# Altium schematic sheet schematic.schdoc
size A3; SheetNumber: 1; SheetTotal: 1
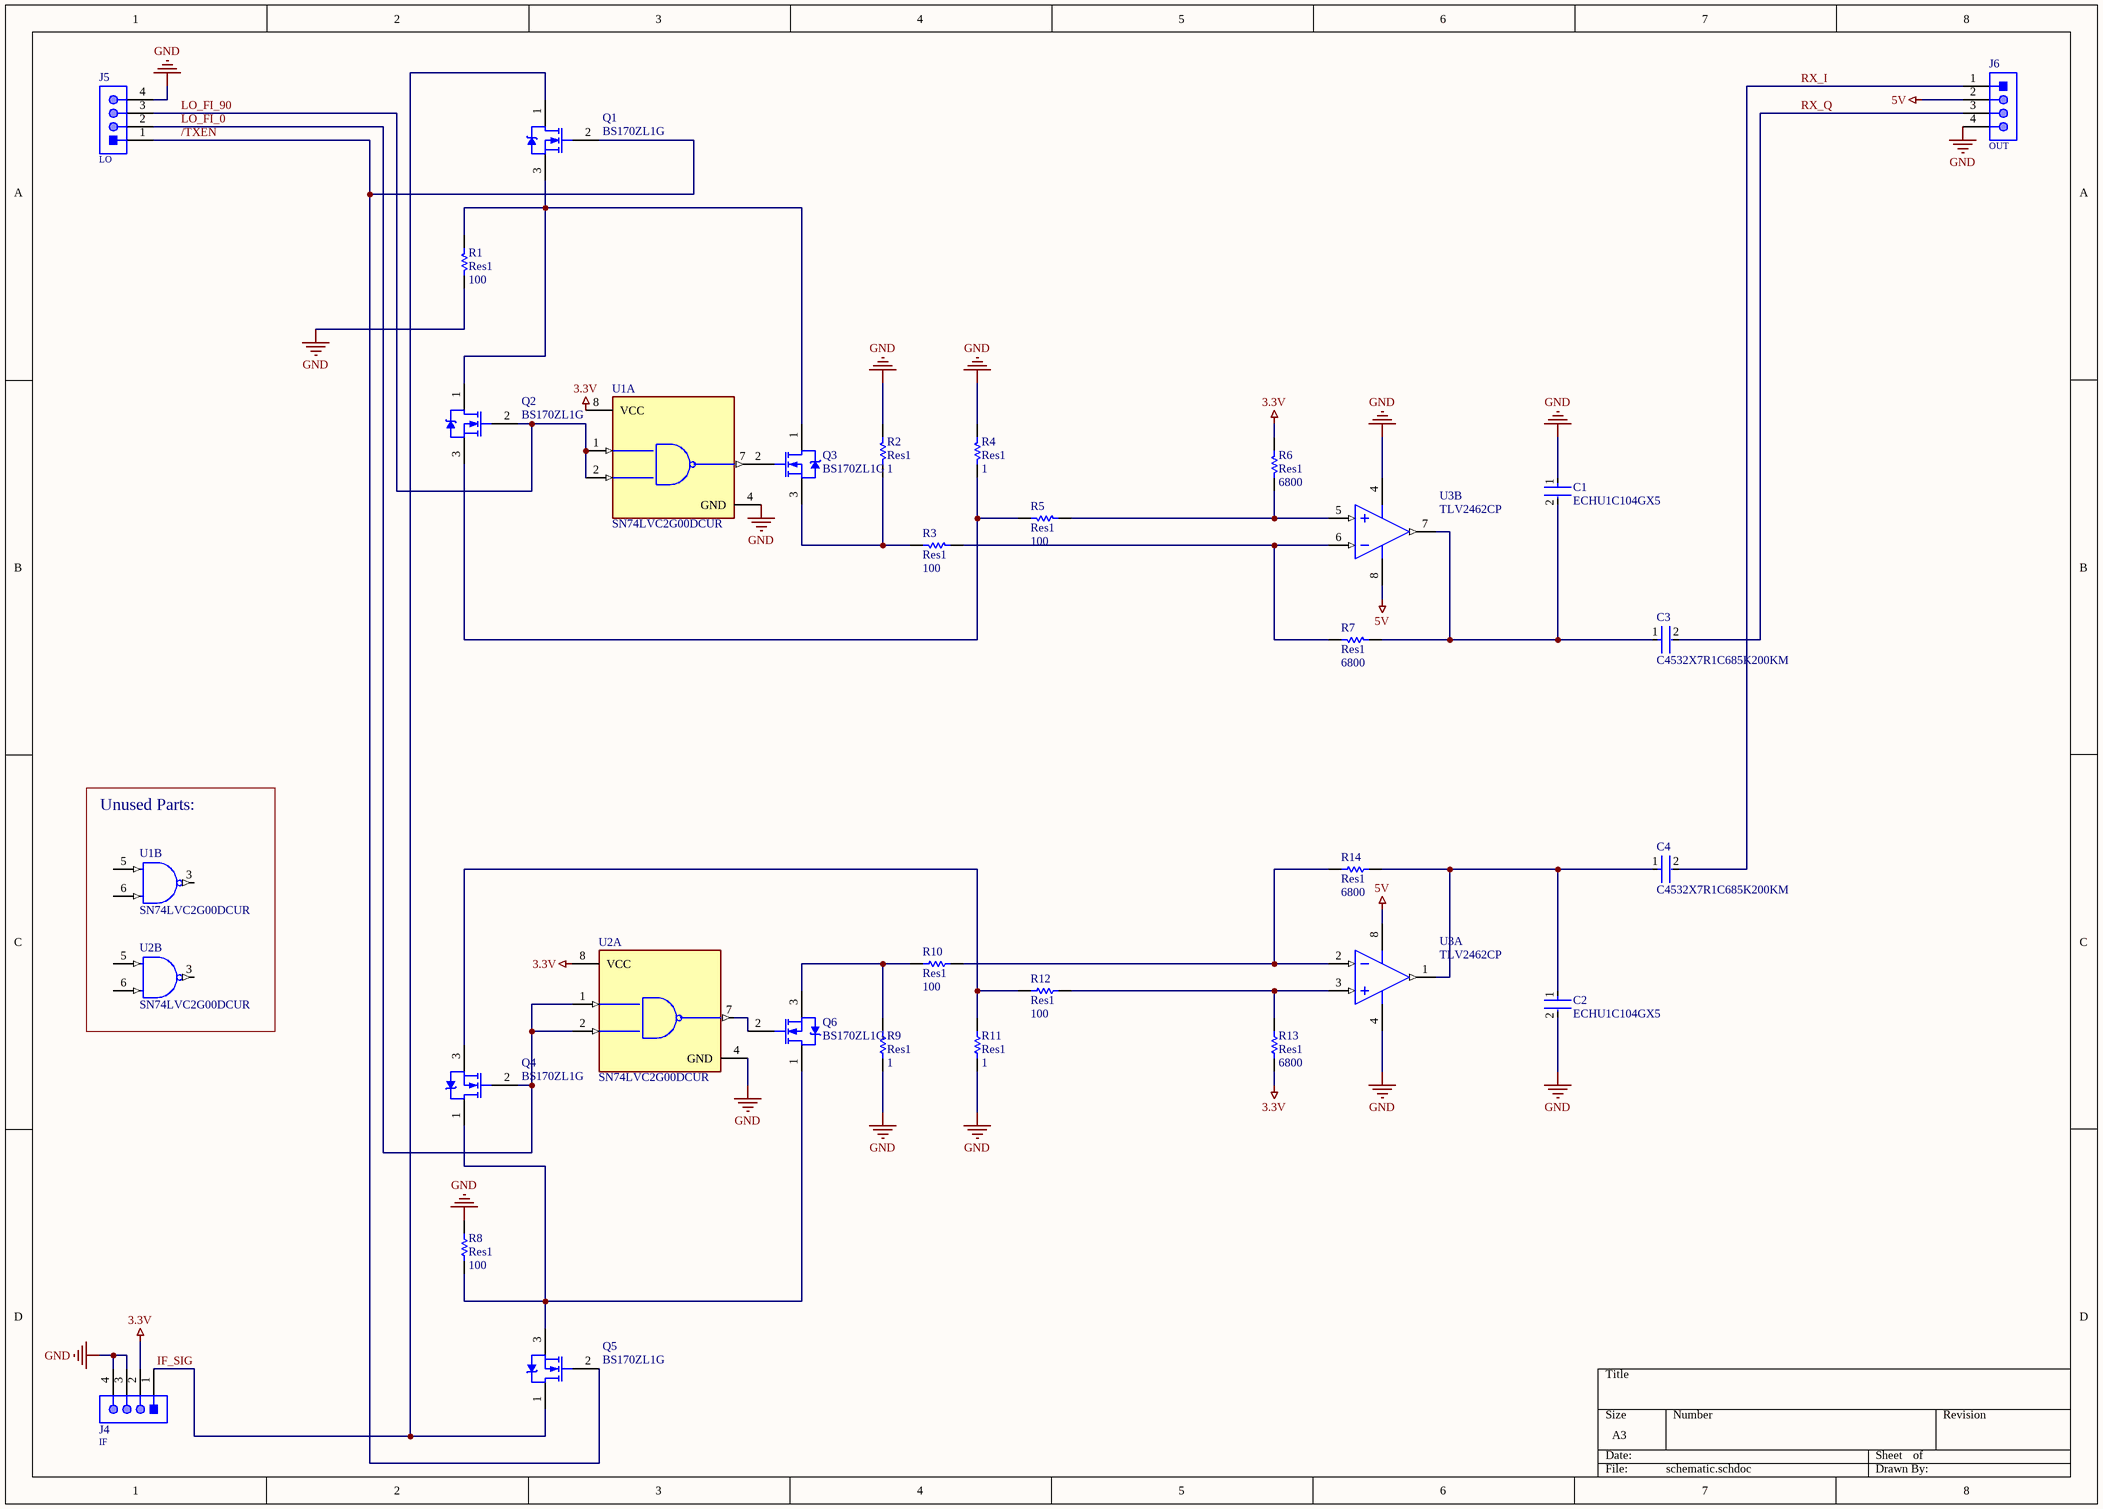
[diagram p0: schematic.schdoc]

## Parts
C1  ECHU1C104GX5  [FP-ECHUG3-MFG]
C2  ECHU1C104GX5  [FP-ECHUG3-MFG]
C3  C4532X7R1C685K200KM  [FP-C4532-200-0_4-IPC_B]
C4  C4532X7R1C685K200KM  [FP-C4532-200-0_4-IPC_B]
J4  IF  [61300411121]
J5  LO  [61300411121]
J6  OUT  [61300411121]
Q1  BS170ZL1G  [ONSC-TO-92-3-29-11_AM_BL]
Q2  BS170ZL1G  [ONSC-TO-92-3-29-11_AM_BL]
Q3  BS170ZL1G  [ONSC-TO-92-3-29-11_AM_BL]
Q4  BS170ZL1G  [ONSC-TO-92-3-29-11_AM_BL]
Q5  BS170ZL1G  [ONSC-TO-92-3-29-11_AM_BL]
Q6  BS170ZL1G  [ONSC-TO-92-3-29-11_AM_BL]
R1  Res1  value 100  [RAD-0.1]
R2  Res1  value 1  [RAD-0.1]
R3  Res1  value 100  [RAD-0.1]
R4  Res1  value 1  [RAD-0.1]
R5  Res1  value 100  [RAD-0.1]
R6  Res1  value 6800  [RAD-0.1]
R7  Res1  value 6800  [RAD-0.1]
R8  Res1  value 100  [RAD-0.1]
R9  Res1  value 1  [RAD-0.1]
R10  Res1  value 100  [RAD-0.1]
R11  Res1  value 1  [RAD-0.1]
R12  Res1  value 100  [RAD-0.1]
R13  Res1  value 6800  [RAD-0.1]
R14  Res1  value 6800  [RAD-0.1]
U1  SN74LVC2G00DCUR  [FP-DCU0008A-IPC_C]  (parts A,B of 2)
U2  SN74LVC2G00DCUR  [FP-DCU0008A-IPC_C]  (parts A,B of 2)
U3  TLV2462CP  [P0008A]  (parts A,B of 2)

## Blocks framed on the sheet
Unused Parts:: U1 U2

## Nets
3.3V: J4.2 R6.1 R13.1 U1.8(VCC) U2.8(VCC)
5V: J6.2 U3.8(VDD+)
GND: C1.1 C2.2 J4.3 J4.4 J5.4 J6.4 R1.2 R2.1 R4.1 R8.2 R9.1 R11.1 U1.4(GND) U2.4(GND) U3.4(GND)
/TXEN: J5.1 Q1.2(G) Q5.2(G)
IF_SIG: J4.1 Q1.1(D) Q5.1(D)
LO_FI_0: J5.2 Q4.2(G) U2.1(1A) U2.2(1B)
LO_FI_90: J5.3 Q2.2(G) U1.1(1A) U1.2(1B)
RX_I: C4.2 J6.1
RX_Q: C3.2 J6.3
NetC1_2: C1.2 C3.1 R7.2 U3.7(OUT2)
NetC2_1: C2.1 C4.1 R14.2 U3.1(OUT1)
NetQ1_3: Q1.3(S) Q2.1(D) Q3.1(D) R1.1
NetQ2_3: Q2.3(S) R4.2 R5.1
NetQ3_2: Q3.2(G) U1.7(1Y)
NetQ3_3: Q3.3(S) R2.2 R3.1
NetQ4_1: Q4.1(D) Q5.3(S) Q6.1(D) R8.1
NetQ4_3: Q4.3(S) R11.2 R12.1
NetQ6_2: Q6.2(G) U2.7(1Y)
NetQ6_3: Q6.3(S) R9.2 R10.1
NetR3_2: R3.2 R7.1 U3.6(IN2-)
NetR5_2: R5.2 R6.2 U3.5(IN2+)
NetR10_2: R10.2 R14.1 U3.2(IN1-)
NetR12_2: R12.2 R13.2 U3.3(IN1+)

Not connected (* = marked no-connect by the designer): U1 3(2Y) 5(2A) 6(2B); U2 3(2Y) 5(2A) 6(2B)

## Library data of the parts
C1 C2 = CMP-05434-000004-1: CAP FILM 0.1UF 2% 16VDC 1210; Dissipation Factor: 0.6%; Dielectric: PPS; Voltage: 16V; Life (Hours): 500Hour; Insulation Resistance: 3GR; Capacitance: 100nF; Dielectric Material: Polyphenylene; Construction: Flat; RoHS Compliant: Yes; Package Quantity: 1; Tolerance: 2%; Case Code (Imperial): 1210; Packaging: Tape and Reel; Width: 2.5mm; Number of Pins: 2; Height: 2.1mm; Lead Free: Lead Free; Case Code (Metric): 3225; REACH SVHC: No SVHC; Series: ECHU(X); Length: 3.2mm; Height - Seated (Max): 0.091inch; Max Operating Temperature: 125°C; Min Operating Temperature: -55°C; Mount: Surface Mount; Voltage Rating: 16V; Contact Plating: Copper; Termination: SMD/SMT; Voltage Rating (DC): 16V; Radiation Hardening: No; Depth: 2.5mm; Case/Package: 1210
C3 C4 = CMP-08246-005601-1: Multilayer Ceramic Capacitors 6.8uF ±10% 16V X7R SMD 1812; Thickness: 0.087inch; Number of Pins: 2; Weight: 0.000952oz; Depth: 3.2mm; RoHS Compliant: Yes; Case Code (Metric): 4532; Case/Package: 1812; Mount: Surface Mount; Packaging: Tape and Reel; Min Operating Temperature: -55°C; Length: 0.177inch; Dielectric: X7R; Case Code (Imperial): 1812; Width: 0.126inch; Series: C; Capacitance: 6.8uF; Voltage Rating: 16V; Max Operating Temperature: 125°C; Resistor Type: Ceramic; Lead Free: Lead Free; Voltage Rating (DC): 16V; Termination: SMD/SMT; Height: 2mm; Tolerance: 10%; Package Quantity: 1000
J4-J6 = CMP-1502-01064-1: THT Vertical Pin Header WR-PHD, Pitch 2.54 mm, Single Row, 4 pins; Manufacturer: Wurth Elektronik; Withstanding Voltage: 500VAC; Rated Current: 3A; Working Voltage: 250VAC; Pin Number: 4; Gender: Male; Contact Resistance: 20mOhm; Pitch: 2.54mm; Manufacturer URL: http://www.we-online.de; Operating Temperature: -40to105degC; Packaging: Bag; Mounting Technology: THT; Package Reference: 61300411121; Datasheet URL: https://katalog.we-online.de/em/datasheet/6130xx11121.pdf; Publisher: WurthElektronik; Part Number: 61300411121; Row Number: Single; Orientation: Vertical
Q1-Q6 = CMP-1058-00939-1: Small Signal MOSFET, 500 mA, 60 V, N-Channel, 3-Pin TO-92, Pb-Free, Tape and Reel; Manufacturer: On Semiconductor; PD Max (W): 0.35; Channel Polarity: N Channel; VGS Max (V): 20; VGS(th) Max (V): 3; ID Max (A): 0.5; V(BR)DSS Min (V): 60; Configuration: Single; PackageDescription: 3-Pin Transistor Outline, Body 4.825 x 3.685 mm, Pitch 1.27 mm; RoHS: Pb-Free; ComponentLink1URL: http://www.onsemi.com/; ComponentLink1Description: Manufacturer URL; Mounting Technology: Through Hole; ComponentLink3URL: http://www.onsemi.com/pub_link/Collateral/MAC97-D.PDF; Package Type: TO-92; ComponentLink2Description: Datasheet; Packing: Tape and Reel; DatasheetVersion: Rev. 6; PartNumber: BS170ZL1G; PackageVersion: Rev. AM; ComponentLink2URL: http://www.onsemi.com/pub_link/Collateral/BS170-D.PDF; ComponentLink3Description: Package Specification; PackageReference: TO-92-3-29-11_AM_BL
R1-R14 = Res1: Resistor; Published: 8-Jun-2000; LatestRevisionDate: 17-Jul-2002; LatestRevisionNote: Re-released for DXP Platform.; PackageReference: AXIAL-0.3; Publisher: Altium Limited; PackageDescription: Axial Device, Thru-Hole; 2 Leads; 0.3 in Pin Spacing
U1 U2 = CMP-0859-00705-4: IC GATE NAND 2CH 2-INP US8; Number of Input Lines: 2; Quiescent Current: 10uA; Number of Output Lines: 1; Output Current: 32mA; Min Supply Voltage: 1.65V; Max Supply Voltage: 5.5V; Turn-On Delay Time: 3.3ns; High Level Output Current: -32mA; Logic Function: NAND GATE; Case/Package: VSSOP; Number of Gates: 2; Weight: 0.000339oz; Termination: SMD/SMT; Number of Elements: 2; Package Quantity: 1; Min Operating Temperature: -40°C; Number of Outputs: 1; Packaging: Tape and Reel; Low Level Output Current: 32mA; Number of Inputs: 2; Mount: Surface Mount; Contact Plating: Gold; Max Output Current: 32mA; RoHS Compliant: Yes; Radiation Hardening: No; Max Operating Temperature: 125°C; Number of Circuits: 2; Lead Free: Lead Free; Propagation Delay: 3.3ns; Number of Pins: 8; REACH SVHC: No SVHC; Number of Bits: 2
U3 = CMP-0272-01601-3: Dual Low-Power, Rail-to-Rail Input / Output Operational Amplifier, 2.7 to 6 V, 0 to 70 degC, 8-pin DIP (P8), Pb-Free (RoHS); Manufacturer: Texas Instruments; Total Supply Voltage(Max)(+5V is 5, +/-5V is 10): 6; Sub Family: High Output Current Amplifier (>=50mA), Low Supply Voltage Amplifier (<=2.7V), Precision Amplifier; Vio (25C)(Max)(mV): 2; Iq per channel(Max)(mA): 0.575; Slew Rate(Typ)(V/us): 1.6; Total Supply Voltage(Min)(+5V is 5, +/-5V is 10): 2.7; Vn at 1kHz(Typ)(nV/rtHz): 11; CMRR(Min)(dB): 66; IIB(Max)(pA): 14000; ComponentLink2URL: http://www.ti.com/general/docs/lit/getliterature.tsp?genericPartNumber=TLV2462&fileType=pdf; Code_JEDEC: MS-001; PackageReference: P0008A; Number of Channels: 2; ComponentLink1Description: Manufacturer URL; Eco-Plan: Pb-Free (RoHS); PackageDescription: 8-Pin Plastic In-Line, Body 9.59 x 6.35 mm, Pitch 2.54 mm; ComponentLink1URL: http://www.ti.com/; PartNumber: TLV2462CP; ComponentLink3URL: http://www.ti.com/litv/pdf/mpdi001b; Mounting Technology: Through Hole; ComponentLink3Description: Package Specification; Offset Drift(Typ)(uV/C): 2; ComponentLink2Description: Datasheet; DatasheetVersion: SLOS220J; PackageVersion: 4040082/E, 04/2010